# Altium schematic sheet MCU.SchDoc
size 279 x 215 mm; Engineer: Kyle Hong; Revision: 1; SheetNumber: 3; SheetTotal: 3
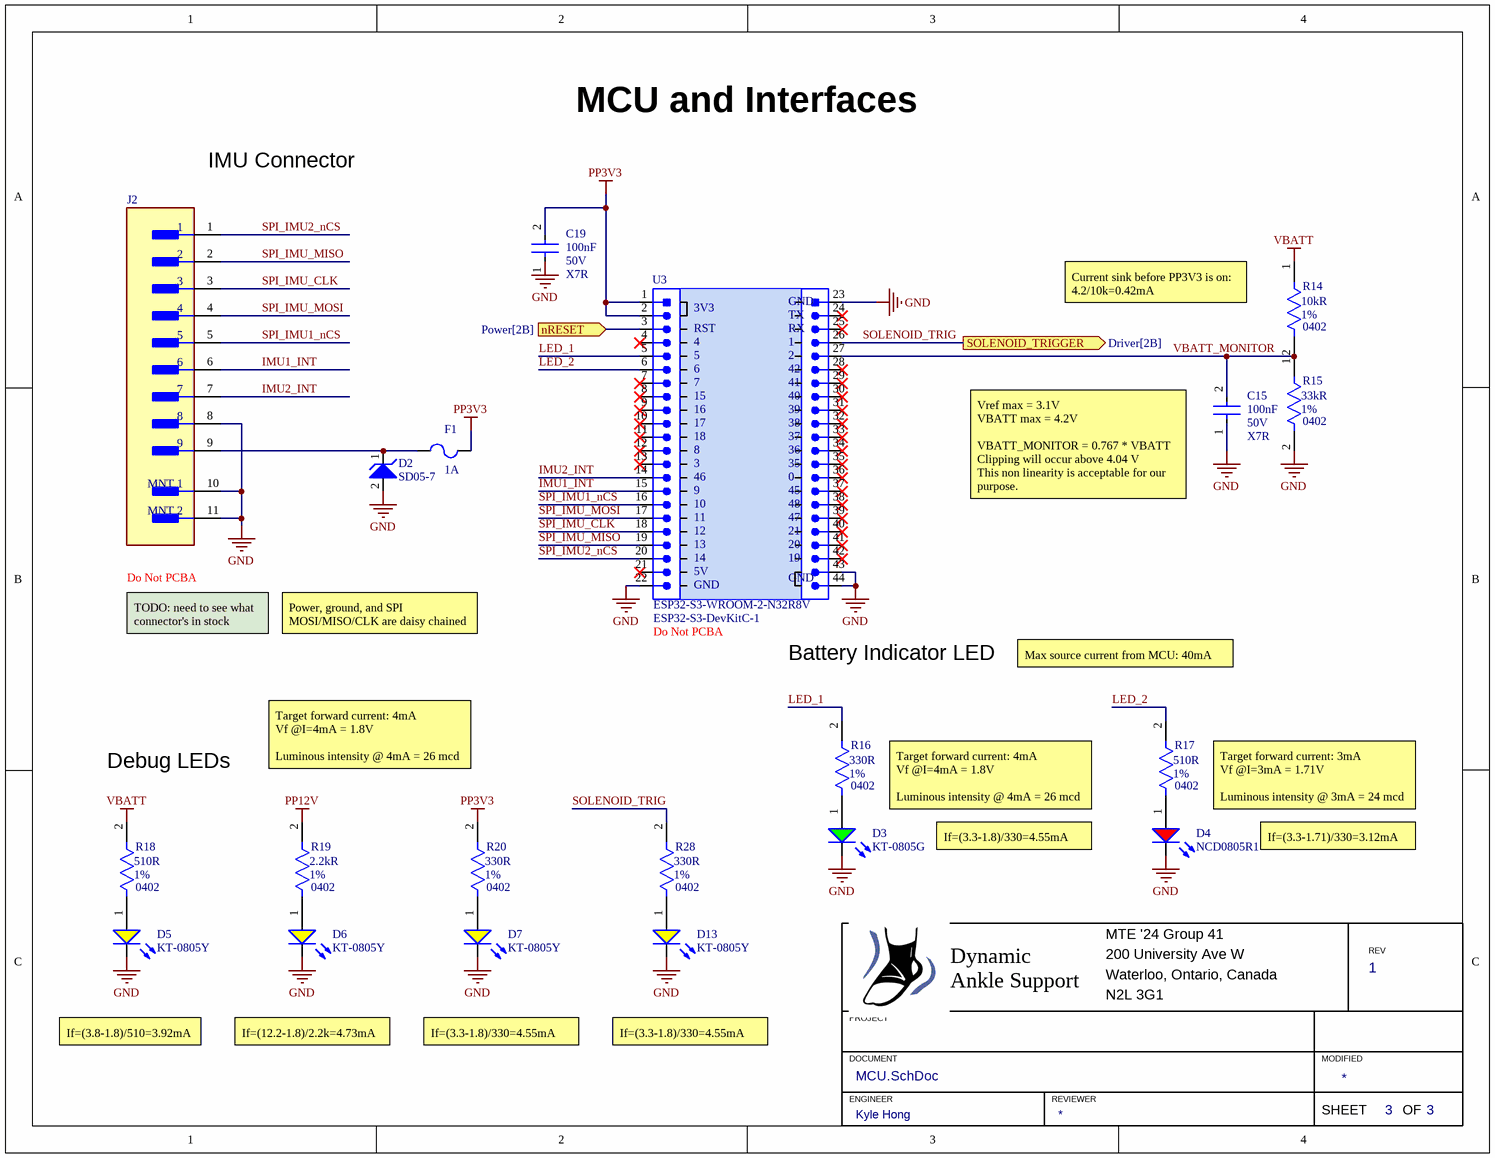
[diagram p0: MCU.SchDoc]

## Parts
C15  Dielectric: X7R  Voltage Rating: 50V  Capacitance: 100nF  [CAP0402]  (hidden comment: CL05B104KB54PNC)
C19  Dielectric: X7R  Voltage Rating: 50V  Capacitance: 100nF  [CAP0402]  (hidden comment: CL05B104KB54PNC)
D2  SD05-7  [SD05-7]
D3  KT-0805G  [LED_0805_GREEN]
D4  NCD0805R1  [LED_0805_RED]
D5  KT-0805Y  [LED_0805_YELLOW]
D6  KT-0805Y  [LED_0805_YELLOW]
D7  KT-0805Y  [LED_0805_YELLOW]
D13  KT-0805Y  [LED_0805_YELLOW]
F1  Current Rating: 1A  [FUSE_0603]  (hidden comment: 0467001.NRHF)
J2  S9B-PH-SM4-TB(LF)(SN)  [FP-S9B-PH-SM4-TB_LF_SN-MFG]  (value not drawn)
R14  Tolerance: 1%  Resistance: 10kR  Package: 0402  [RES0402]  (hidden comment: 0402WGF1002TCE)
R15  Tolerance: 1%  Resistance: 33kR  Package: 0402  [RES0402]  (hidden comment: 0402WGF3302TCE)
R16  Tolerance: 1%  Resistance: 330R  Package: 0402  [RES0402]  (hidden comment: 0402WGF3300TCE)
R17  Tolerance: 1%  Resistance: 510R  Package: 0402  [RES0402]  (hidden comment: 0402WGF5100TCE)
R18  Tolerance: 1%  Resistance: 510R  Package: 0402  [RES0402]  (hidden comment: 0402WGF5100TCE)
R19  Tolerance: 1%  Resistance: 2.2kR  Package: 0402  [RES0402]  (hidden comment: 0402WGF2201TCE)
R20  Tolerance: 1%  Resistance: 330R  Package: 0402  [RES0402]  (hidden comment: 0402WGF3300TCE)
R28  Tolerance: 1%  Resistance: 330R  Package: 0402  [RES0402]  (hidden comment: 0402WGF3300TCE)
U3  Dev Kit Part Number: ESP32-S3-DevKitC-1  [EPS32-S3-DevKitC]  (hidden comment: ESP32-S3-WROOM-2-N32R8V)

## Ports
nRESET (in, see Power[2B]), SOLENOID_TRIGGER (out, see Driver[2B])

## Nets
GND: C15.1 C19.1 D2.2 D3.1(K) D4.1(K) D5.1(K) D6.1(K) D7.1(K) D13.1(K) J2.8 J2.10(MNT_1) J2.11(MNT_2) R15.2 U3.22 U3.23 U3.43 U3.44
PP3V3: C19.2 F1.2 R20.2 U3.1 U3.2
PP12V: R19.2
VBATT: R14.1 R18.2
IMU1_INT: J2.6 U3.15
IMU2_INT: J2.7 U3.14
LED_1: R16.2 U3.5
LED_2: R17.2 U3.6
nRESET: U3.3 ; port nRESET
SOLENOID_TRIG: R28.2 U3.26 ; port SOLENOID_TRIGGER
SPI_IMU1_nCS: J2.5 U3.16
SPI_IMU2_nCS: J2.1 U3.20
SPI_IMU_CLK: J2.3 U3.18
SPI_IMU_MISO: J2.2 U3.19
SPI_IMU_MOSI: J2.4 U3.17
VBATT_MONITOR: C15.2 R14.2 R15.1 U3.27
NetD2_1: D2.1 F1.1 J2.9
NetD3_2: D3.2(A) R16.1
NetD4_2: D4.2(A) R17.1
NetD5_2: D5.2(A) R18.1
NetD6_2: D6.2(A) R19.1
NetD7_2: D7.2(A) R20.1
NetD13_2: D13.2(A) R28.1

Not connected (* = marked no-connect by the designer): U3 4* 7(6)* 8(6)* 9* 10* 11* 12* 13* 21* 24* 25* 28* 29* 30* 31* 32* 33* 34* 35* 36* 37* 38* 39* 40* 41* 42*

## Notes on the sheet
- MCU and Interfaces
- IMU Connector
- (near R14) Current sink before PP3V3 is on:
  4.2/10k=0.42mA
- (near C15) Vref max = 3.1V
  VBATT max = 4.2V
  VBATT_MONITOR = 0.767 * VBATT
  Clipping will occur above 4.04 V
  This non linearity is acceptable for our purpose.
- Do Not PCBA
- TODO: need to see what connector's in stock
- Power, ground, and SPI MOSI/MISO/CLK are daisy chained
- (near U3) Do Not PCBA
- Battery Indicator LED
- Max source current from MCU: 40mA
- Debug LEDs
- Target forward current: 4mA
  Vf @I=4mA = 1.8V
  Luminous intensity @ 4mA = 26 mcd
- Target forward current: 3mA
  Vf @I=3mA = 1.71V
  Luminous intensity @ 3mA = 24 mcd
- If=(3.3-1.8)/330=4.55mA
- If=(3.3-1.71)/330=3.12mA
- If=(3.8-1.8)/510=3.92mA
- If=(12.2-1.8)/2.2k=4.73mA
- 200 University Ave W
- MTE '24 Group 41
- REV
- PROJECT
- Dynamic Ankle Support
- Waterloo, Ontario, Canada
- N2L 3G1
- DOCUMENT
- ENGINEER
- REVIEWER
- MODIFIED
- SHEET
- OF
- (in symbol EPS32-S3-DevKitC) GND; 3V3; TX; RST; RX; 46; 0; 45; 48; 47; 5V

## Library data of the parts
C15 C19 = CAP0402: 50V 100nF X7R ±10% 0402  Multilayer Ceramic Capacitors MLCC - SMD/SMT ROHS; Manufacturer: Samsung Electro-Mechanics; Tolerance: ±20%; Manufacturer Part Number: CL05B104KB54PNC; Package: 0402
D2 = SD05-7: TVS UNI14.5V 6.2V 5V SOD-323; Manufacturer: Diodes Incorporated; Clamping Voltage: 14.5V; Breakdown Voltage: 6.2V; Reverse Standoff Voltage: 5V; Package: SOD-323; Manufacturer Part Number: SD05-7
D3 = LED_GREEN: Emerald 0805  Light Emitting Diodes (LED) ROHS; Manufacturer: Hubei KENTO Elec; Vf: 2.1V; If rated: 20mA; Manufacturer Part Number: KT-0805G
D4 = LED_RED: Colorless transparence 67mcd~195mcd -30℃~+85℃ 615nm~630nm Red 130° 65mW 0805  Light Emitting Diodes (LED) ROHS; Manufacturer: Foshan NationStar Optoelectronics; Vf: 2.0V; If rated: 25mA; Manufacturer Part Number: NCD0805R1
D5-D7 D13 = LED_YELLOW: Yellow 0805  Light Emitting Diodes (LED) ROHS; Manufacturer: Hubei KENTO Elec; Vf: 2.1V; If rated: 20mA; Manufacturer Part Number: KT-0805Y
F1 = FUSE0603: 50A SMD Fuse 1A 32V 32V 0603  Fuses ROHS; Manufacturer: Littelfuse; Manufacturer Part Number: 0467001.NRHF; Package: 0603; Voltage Rating: 32V; Supplier 1: Future Electronics; Supplier Part Number 1: 6130137
J2 = CMP-17439-000494-1: CONN HEADER SMD R/A 9POS 2MM; Voltage Rating (AC): 100V; Number of Poles: 9; Current Rating: 2A; Insulation Resistance: 1GR; Contact Resistance: 10mR; Gender: Male; Max Operating Temperature: 85°C; Number of Rows: 1; Color: White; Housing Color: Natural; Lead Free: Lead Free; Working Voltage: 100V; Contact Finish - Mating: TIN; Series: PH; Fastening Type: Detent; Packaging: Cut Tape; Housing Material: Nylon; Connector Type: Header; Mount: Surface Mount; Pitch: 2mm; Contact Shape: Square; Orientation: Right Angle; Voltage Rating: 100V; Lead Pitch: 2mm; Insulation Color: Natural; Min Operating Temperature: -25°C; Contact Plating: Tin; Contact Type: Male Pin; Reach SVHC Compliant: Yes; Number of Contacts: 9; Contact Material: Copper Alloy; Flammability Rating: UL94 V-0; Insulation Material: Nylon; Termination: Solder; Number of Positions: 9; Contact Mating Length: 0.13inch
R14 = RES0402: 62.5mW Thick Film Resistors ±100ppm/℃ ±1% 10kΩ 0402  Chip Resistor - Surface Mount ROHS; Manufacturer: UNI-ROYAL(Uniroyal Elec); Power Rating: 62.5mW; Manufacturer Part Number: 0402WGF1002TCE
R15 = RES0402: 62.5mW Thick Film Resistors ±100ppm/℃ ±1% 33kΩ 0402  Chip Resistor - Surface Mount ROHS; Manufacturer: UNI-ROYAL(Uniroyal Elec); Power Rating: 62.5mW; Manufacturer Part Number: 0402WGF3302TCE
R16 R20 R28 = RES0402: 62.5mW Thick Film Resistors ±100ppm/℃ ±1% 330Ω 0402  Chip Resistor - Surface Mount ROHS; Manufacturer: UNI-ROYAL(Uniroyal Elec); Power Rating: 62.5mW; Manufacturer Part Number: 0402WGF3300TCE
R17 R18 = RES0402: 62.5mW Thick Film Resistors ±100ppm/℃ ±1% 510Ω 0402  Chip Resistor - Surface Mount ROHS; Manufacturer: UNI-ROYAL(Uniroyal Elec); Power Rating: 62.5mW; Manufacturer Part Number: 0402WGF5100TCE
R19 = RES0402: 62.5mW Thick Film Resistors ±100ppm/℃ ±1% 2.2kΩ 0402  Chip Resistor - Surface Mount ROHS; Manufacturer: UNI-ROYAL(Uniroyal Elec); Power Rating: 62.5mW; Manufacturer Part Number: 0402WGF2201TCE
U3 = EPS32-S3-DevKitC: MCU Part Number: ESP32-S3-WROOM-2-N32R8V